# EAGLE design MAINfin2 (EAGLE 7.4.0)
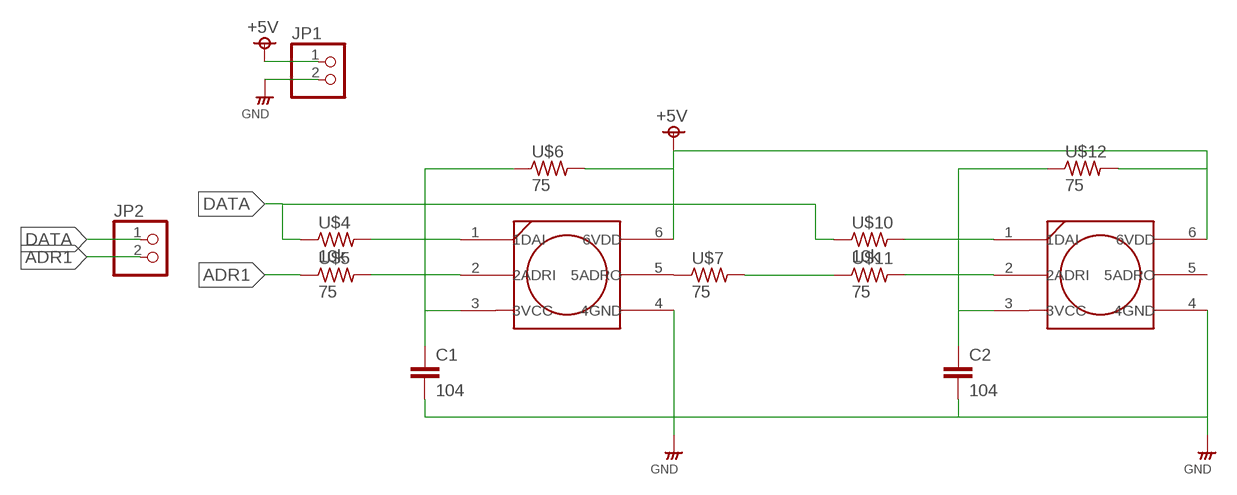
[diagram p0: schematic, sheet 1]

## Parts
C1  104  MLCC-2  [MLCC_25]
C2  104  MLCC-2  [MLCC_25]
JP1  PINHD-1X2"  [1*02]
JP2  PINHD-1X2"  [1*02]
U$1  WS2822S  [WS2822S]
U$4  10k  RESISTORS-3  [R_0.3]
U$5  75  RESISTORS-3  [R_0.3]
U$6  75  RESISTORS-3  [R_0.3]
U$7  75  RESISTORS-3  [R_0.3]
U$8  WS2822S  [WS2822S]
U$10  10k  RESISTORS-3  [R_0.3]
U$11  75  RESISTORS-3  [R_0.3]
U$12  75  RESISTORS-3  [R_0.3]

## Nets
+5V: JP1.1 U$1.6(6VDD) U$6.2 U$8.6(6VDD) U$12.2
ADR1: JP2.2 U$5.1 U$7.2 U$11.1
DATA: JP2.1 U$4.1 U$10.1
GND: C1.2 C2.2 JP1.2 U$1.4(4GND) U$8.4(4GND)
N$1: C1.1 U$1.3(3VCC) U$6.1
N$2: U$1.5(5ADRO) U$7.1
N$4: U$1.1(1DAI) U$4.2
N$5: U$1.2(2ADRI) U$5.2
N$8: U$8.1(1DAI) U$10.2
N$9: U$8.2(2ADRI) U$11.2
N$10: C2.1 U$8.3(3VCC) U$12.1
Unconnected: U$8.5(5ADRO)

## Library data of the parts
C1 C2 = rcl__s:MLCC: CAPACITOR, European symbol
JP1 JP2 = pinhead_s:PINHD-1X2: PIN HEADER
U$1 U$8 = WS2822S:WS2822S
U$4-U$7 U$10-U$12 = rcl__s:RESISTORS

## Board
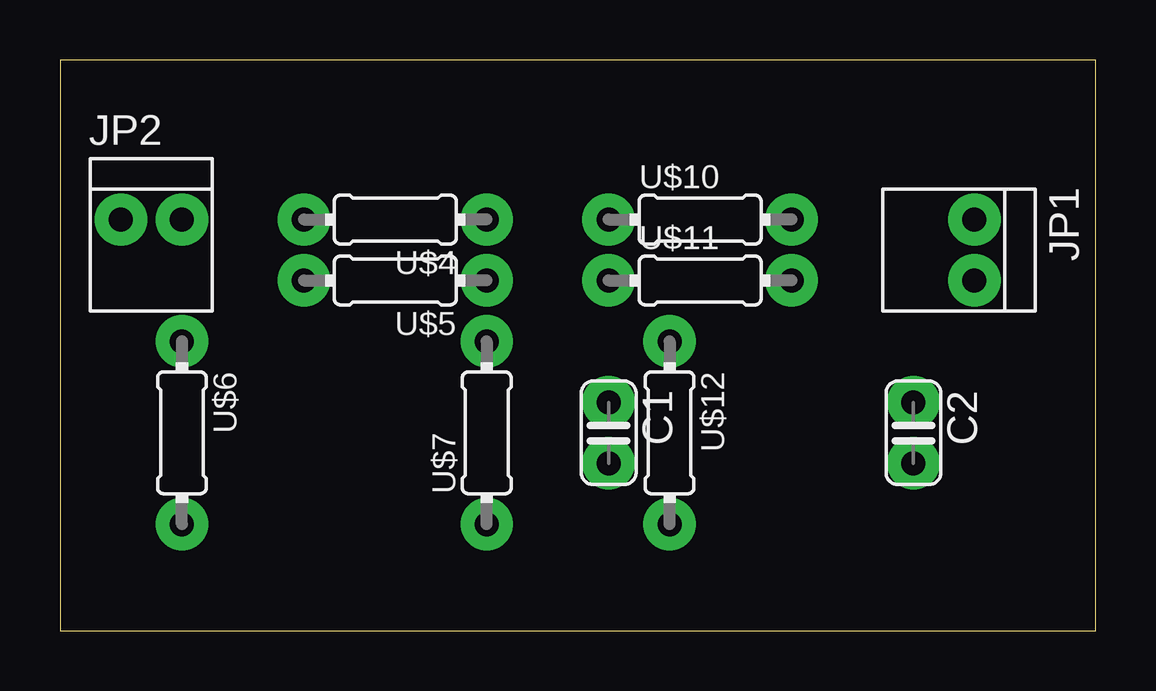
[diagram p1: board, top side]
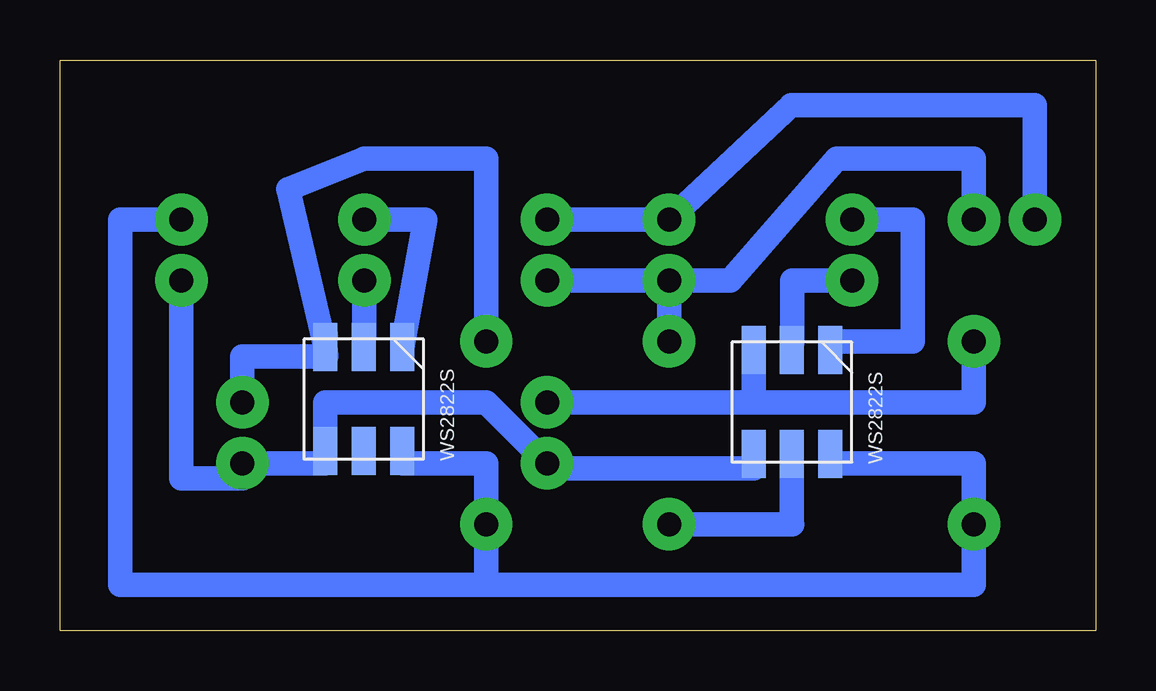
[diagram p2: board, bottom side, seen from below]

Size 43.16 x 23.8 mm. Coordinates in mm from the lower left corner, seen from the top.
Outline: 0,0 43.16,0 43.16,23.8 0,23.8 0,0
Copper layers (1*16): Top 0.035mm / dielectric 1.5mm / Bottom 0.035mm
Design rules "default": minimum track width 10mil, minimum drill 24mil, track to track 8mil, track to pad 8mil, pad to pad 8mil, via to via 8mil, smd to smd 8mil, copper to edge 40mil, drill to drill 8mil, minimum pad ring 10mil, minimum via ring 8mil, stop-mask expansion 4mil, vias tented up to drill 0mil, thermal gap 10mil

### Footprints (pad centres in the part's own frame; a part is rotated, then mirrored left to right if it is on the bottom)
MLCC_25 = drill 1 pad 2.184: 1 -1.27,0; 2 1.27,0
1*02 = drill 1 pad 2.184: 1 -1.27,0; 2 1.27,0
WS2822S = smd 2 x 1: 1 1.665,-1.1; 2 1.665,0.5; 3 1.665,2.1; 4 -2.665,2.1; 5 -2.665,0.5; 6 -2.665,-1.1
R_0.3 = drill 1 pad 2.184: 1 -3.81,0; 2 3.81,0; 3 -3.81,0

### Placement (x,y rotation side)
C1  22.86,8.26 270 top
C2  35.56,8.26 270 top
JP1  38.1,15.88 270 top
JP2  3.81,17.14 0 top
U$1  12.16,10.03 90 bottom
U$4  13.97,17.14 180 top
U$5  13.97,14.61 180 top
U$6  5.08,8.26 270 top
U$7  17.78,8.26 90 top
U$8  30,10.16 90 bottom
U$10  26.67,17.14 0 top
U$11  26.67,14.61 0 top
U$12  25.4,8.26 270 top

### Tracks (layer width: path | path; a pad name or v marks a point on that pad's centre or on a via)
+5V
  Bottom 1.016: U$1.6 11.06,6.99 5.08,6.99 U$6.2 5.08,1.91 25.4,1.91 | 25.4,1.91 U$12.2 25.4,6.99 28.9,6.99 U$8.6 | JP1.1 40.64,17.14 40.64,1.91 25.4,1.91
ADR1
  Bottom 1.016: U$11.1 U$5.1 | U$7.2 U$5.1 | U$5.1 15.24,14.61 10.79,19.68 5.08,19.68 JP2.2
DATA
  Bottom 1.016: U$10.1 U$4.1 12.7,21.91 2.54,21.91 JP2.1
GND
  Bottom 1.016: JP1.2 38.1,6.35 35.56,6.35 C2.2 32.1,6.99 U$8.4 32.1,9.53 25.4,9.53 C1.2 22.86,6.77 14.26,6.77 U$1.4
N$1
  Bottom 1.016: C1.1 14.26,9.53 | 14.26,9.53 5.08,9.53 U$6.1 | U$1.3 14.26,11.38 14.26,9.53
N$2
  Bottom 1.016: U$7.1 12.66,4.45 | 12.66,4.45 | 12.66,4.45 U$1.5
N$4
  Bottom 1.016: U$4.2 7.62,17.14 7.62,12.06 10.96,12.06 U$1.1
N$5
  Bottom 1.016: U$1.2 12.65,12.07 12.65,14.61 | U$5.2 12.65,14.61 | 12.66,14.61 12.65,14.61
N$8
  Bottom 1.016: U$10.2 27.94,17.14 U$8.1
N$9
  Bottom 1.016: U$8.2 30.48,12.4 U$11.2
N$10
  Bottom 1.016: U$12.1 25.4,19.68 30.48,19.68 33.66,18.41 U$8.3 | U$8.3 32.09,12.37 | U$8.3 32.07,11.43 35.56,11.43 C2.1